# Altium project Level Shifter Pi Hat.PrjPcb
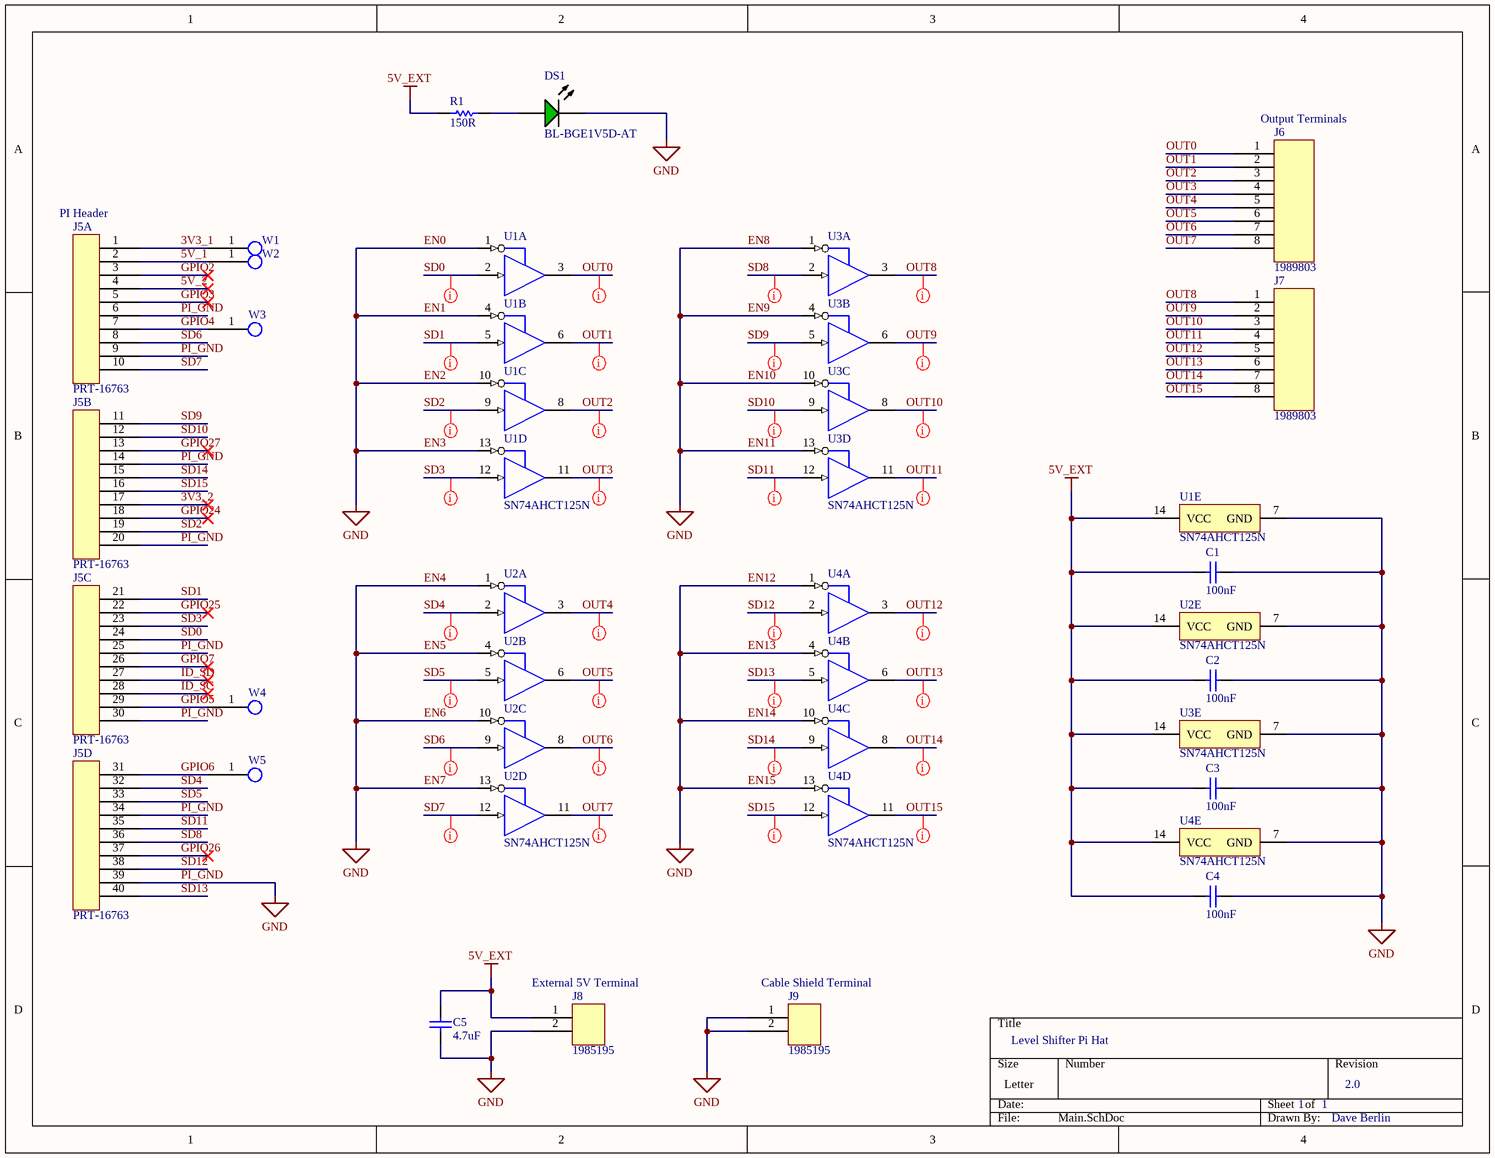
[diagram p0: Main.SchDoc]
DrawnBy: Dave Berlin; Revision: 2.0; Title: Level Shifter Pi Hat
1 sheet, 21 parts. Net scope: global (net labels, ports and power ports of the same name join across sheets).
Board file: Main.PcbDoc

## Sheet Main.SchDoc: Level Shifter Pi Hat
size Letter; SheetNumber: 1; SheetTotal: 1

### Parts
C1  value 100nF  [FP-CL21-IPC_A]  (hidden comment: CL21B104KBCNNNC)
C2  value 100nF  [FP-CL21-IPC_A]  (hidden comment: CL21B104KBCNNNC)
C3  value 100nF  [FP-CL21-IPC_A]  (hidden comment: CL21B104KBCNNNC)
C4  value 100nF  [FP-CL21-IPC_A]  (hidden comment: CL21B104KBCNNNC)
C5  value 4.7uF  [FP-CL21-IPC_A]  (hidden comment: CL21A475KAQNNNE)
DS1  BL-BGE1V5D-AT  [LED-2P-2.54-3MM]
J5  PRT-16763  [PRT-16763-Footprint-1]  (parts A,B,C,D of 4)
J6  1989803  [CONN_1989803_PXC]
J7  1989803  [CONN_1989803_PXC]
J8  1985195  [CONN_1985195_PXC]
J9  1985195  [CONN_1985195_PXC]
R1  value 150R  [STA_CF14_STP]  (hidden comment: CF14JT150R)
U1  SN74AHCT125N  [N0014A]  (value not drawn)  (parts A,B,C,D,E of 5)
U2  SN74AHCT125N  [N0014A]  (value not drawn)  (parts A,B,C,D,E of 5)
U3  SN74AHCT125N  [N0014A]  (value not drawn)  (parts A,B,C,D,E of 5)
U4  SN74AHCT125N  [N0014A]  (value not drawn)  (parts A,B,C,D,E of 5)
W1  WIRE-PAD-20AWG  [WIRE-PAD-20AWG]  (value not drawn)  (no BOM)
W2  WIRE-PAD-20AWG  [WIRE-PAD-20AWG]  (value not drawn)  (no BOM)
W3  WIRE-PAD-20AWG  [WIRE-PAD-20AWG]  (value not drawn)  (no BOM)
W4  WIRE-PAD-20AWG  [WIRE-PAD-20AWG]  (value not drawn)  (no BOM)
W5  WIRE-PAD-20AWG  [WIRE-PAD-20AWG]  (value not drawn)  (no BOM)

### Nets
5V_EXT: C1.1 C2.1 C3.1 C4.1 C5.2 J8.1 R1.1 U1.14(VCC) U2.14(VCC) U3.14(VCC) U4.14(VCC)
EN0: C1.2 C2.2 C3.2 C4.2 C5.1 DS1.2(K) J5.6 J5.9 J5.14 J5.20 J5.25 J5.30 J5.34 J5.39 J8.2 J9.1 J9.2 U1.1(1~{OE}) U1.4(2~{OE}) U1.7(GND) U1.10(3~{OE}) U1.13(4~{OE}) U2.1(1~{OE}) U2.4(2~{OE}) U2.7(GND) U2.10(3~{OE}) U2.13(4~{OE}) U3.1(1~{OE}) U3.4(2~{OE}) U3.7(GND) U3.10(3~{OE}) U3.13(4~{OE}) U4.1(1~{OE}) U4.4(2~{OE}) U4.7(GND) U4.10(3~{OE}) U4.13(4~{OE})  [also labelled EN1, EN10, EN11, EN12, EN13, EN14, EN15, EN2, EN3, EN4, EN5, EN6, EN7, EN8, EN9, GND, PI_GND]
3V3_1: J5.1 W1.1
3V3_2: J5.17
5V_1: J5.2 W2.1
5V_2: J5.4
GPIO2: J5.3
GPIO3: J5.5
GPIO4: J5.7 W3.1
GPIO5: J5.29 W4.1
GPIO6: J5.31 W5.1
GPIO7: J5.26
GPIO24: J5.18
GPIO25: J5.22
GPIO26: J5.37
GPIO27: J5.13
ID_SC: J5.28
ID_SD: J5.27
OUT0: J6.1 U1.3(1Y)
OUT1: J6.2 U1.6(2Y)
OUT2: J6.3 U1.8(3Y)
OUT3: J6.4 U1.11(4Y)
OUT4: J6.5 U2.3(1Y)
OUT5: J6.6 U2.6(2Y)
OUT6: J6.7 U2.8(3Y)
OUT7: J6.8 U2.11(4Y)
OUT8: J7.1 U3.3(1Y)
OUT9: J7.2 U3.6(2Y)
OUT10: J7.3 U3.8(3Y)
OUT11: J7.4 U3.11(4Y)
OUT12: J7.5 U4.3(1Y)
OUT13: J7.6 U4.6(2Y)
OUT14: J7.7 U4.8(3Y)
OUT15: J7.8 U4.11(4Y)
SD0: J5.24 U1.2(1A)
SD1: J5.21 U1.5(2A)
SD2: J5.19 U1.9(3A)
SD3: J5.23 U1.12(4A)
SD4: J5.32 U2.2(1A)
SD5: J5.33 U2.5(2A)
SD6: J5.8 U2.9(3A)
SD7: J5.10 U2.12(4A)
SD8: J5.36 U3.2(1A)
SD9: J5.11 U3.5(2A)
SD10: J5.12 U3.9(3A)
SD11: J5.35 U3.12(4A)
SD12: J5.38 U4.2(1A)
SD13: J5.40 U4.5(2A)
SD14: J5.15 U4.9(3A)
SD15: J5.16 U4.12(4A)
NetDS1_1: DS1.1(A) R1.2

### Layout directives
net class HighSpeed: OUT0, OUT1, OUT2, OUT3, OUT4, OUT5, OUT6, OUT7, OUT8, OUT9, OUT10, OUT11, OUT12, OUT13, OUT14, OUT15, SD0, SD1, SD2, SD3, SD4, SD5, SD6, SD7, SD8, SD9, SD10, SD11, SD12, SD13, SD14, SD15

### Notes on the sheet
- (near J6) Output Terminals
- (near J5) PI Header
- (near J8) External 5V Terminal
- (near J9) Cable Shield Terminal

### Library data of the parts
C1-C4 = CMP-001-00097-1: CAP CER 0.1UF 50V X7R 0805; Material: Ceramic; Tolerance: 10%; Depth: 1.25mm; Case Code (Imperial): 0805; Height: 0.85mm; Dielectric: X7R; Case/Package: 0805; Max Operating Temperature: 125°C; Voltage Rating: 50V; Radiation Hardening: No; RoHS Compliant: Yes; Mounting Technology: Surface Mount; Length: 2mm; Construction: Flat; Packaging: Tape and Reel; Lead Free: Lead Free; Min Operating Temperature: -55°C; Voltage: 50V; Case Code (Metric): 2012; Voltage Rating (DC): 50V; Series: CL; Width: 0.049inch; Thickness: 0.037inch
C5 = CMP-001-00095-2: CAP CER 4.7UF 25V X5R 0805; Tolerance: 10%; RoHS Compliant: Yes; Depth: 1.25mm; Min Operating Temperature: -55°C; Case/Package: 0805; Length: 2mm; Voltage Rating (DC): 25V; Max Operating Temperature: 85°C; Radiation Hardening: No; Lead Free: Lead Free; Height: 1.25mm; Dielectric: X5R; Construction: Flat; Series: CL; Voltage Rating: 25V; Case Code (Imperial): 0805; Packaging: Tape and Reel; Mounting Technology: Surface Mount; Case Code (Metric): 2012
DS1 = CMP-007-00038-2: LED Green, 80 mW, 30 mA Max, 200 mcd at 20 mA-40 to 85 degC, 2-Pin THD, RoHS, Bulk; Power: 80mW; Lens Style: Dome; Forward Voltage: 2V; Viewing Angle: 35degrees; Forward Current: 30mA; Case/Package: Radial; Colour: Green; Illumination Colour: Green; Mounting Technology: TH
J5 = CMP-002-00082-1: Extended GPIO Female Header - 2x20 Pin (16mm/7.30mm); Number of Positions: 40; Contact Shape: Square; Contact Type: Forked; Flammability Rating: UL94 V-0; Max Operating Temperature: 105°C; Fastening Type: Pull; Termination: Solder; Insulation Color: Black; Contact Finish - Mating: GOLD; Insulation Material: Nylon; Series: -; Number of Rows: 2; Contact Material: Brass; Mounting Technology: Through Hole; Min Operating Temperature: -40°C
J6 J7 = CMP-002-00083-1: Conn PC Terminal Block 8 POS 2.5mm Solder Thru-Hole 2A; Wire Gauge (Min): 20AWG; Number of Positions Per Level: 8; Voltage: 300V; Approvals: UL,VDE,EAC; Number of Levels: 1; Wire Gauge (Max): 26AWG; Voltage Rating: 250V; Weight: 0.109702oz; Packaging: Bulk; Package Quantity: 100; Pitch: 2.5mm; Height: 13.1mm; Number of Poles: 8; Min Operating Temperature: -40°C; Lead Free: Lead Free; Max Operating Temperature: 85°C; Wire/Cable Gauge: 20AWG; Current: 2A; Color: Green; Width: 21.5mm; Length: 12mm; Termination: Screwless; Series: PTSA; Contact Material: Copper Alloy; Material: Nylon; Number of Ways: 8; Number of Positions: 8; Pins: 8; RoHS Compliant: Yes; Current Rating: 2A; Number of Rows: 1; Mounting Technology: Through Hole; Housing Color: Green; Housing Material: Nylon
J8 J9 = CMP-002-00079-2: Conn PC Terminal Block 2 POS 3.5mm Solder Thru-Hole 8A Cardboard; Number of Positions: 2; Max Current Rating: 2A; Wire/Cable Gauge: 16AWG; Voltage Rating: 250V; Number of Levels: 1; Approvals: UL,VDE,EAC; Voltage: 300V; Wire Gauge (Max): 24AWG; Weight: 0.043387oz; Termination: Solder; Pins: 2; Housing Color: Green; Number of Ways: 2; Lead Free: Lead Free; Packaging: Bulk; Reach SVHC Compliant: Unknown; Height: 13.1mm; Material: Nylon; Current: 2A; Wire Gauge (Min): 16AWG; Color: Green; Pitch: 3.5mm; Depth: 12mm; Number of Circuits: 2; Number of Rows: 1; Package Quantity: 250; Width: 16.7mm; Contact Material: Tin; Housing Material: Polyamide; Number of Poles: 2; Length: 8.5mm; Flammability Rating: UL94 V-2; Current Rating: 2A; Number of Positions Per Level: 2; RoHS Compliant: Yes; Max Supply Voltage: 250V; Mounting Technology: Through Hole; Series: COMBICON PTSA; Number of Contacts: 2
R1 = CMP-009-00191-1: CF Series 0.25 W 150 Ohm ±5 % 0 to -400 ppm/°C Through Hole Carbon Film Resistor; Max Power Dissipation: 250mW; Tolerance: 5%; RoHS Compliant: Yes; Power Rating: 250mW; Contact Plating: Tin,Matte; Lead Free: Lead Free; Series: CF; Min Operating Temperature: -55°C; Number of Terminations: 2; Termination: Axial; Military Standard: Not; Radiation Hardening: No; Temperature Coefficient: -400ppm/°C; Packaging: Tape and Reel; Case/Package: Conformal; Construction: Cylindrical; Length: 6.5mm; Mounting Technology: Through Hole,Axial; Diameter: 2.3mm; Max Operating Temperature: 155°C; Features: Flame Retardant Coating
U1-U4 = CMP-024-00000-1: Buffer/Line Driver 4-CH Non-Inverting 3-ST CMOS 14-Pin PDIP Tube; Number of Elements: 4; Quiescent Current: 2uA; Min Supply Voltage: 4.5V; Turn-On Delay Time: 10ns; Number of Bits per Element: 1; Logic Function: Buffer,Inverting; Max Supply Voltage: 5.5V; High Level Output Current: -8mA; Output Type: 3-STATE; Operating Supply Voltage: 5V; Propagation Delay: 7.5ns; Low Level Output Current: 8mA; Packaging: Rail/Tube; Package Quantity: 25; Termination: Through Hole; Pins: 14; Number of Inputs: 4; Polarity: Non-Inverting; Technology: CMOS; Number of Channels: 4; Case/Package: PDIP; Series: 74AHCT; Max Operating Temperature: 125°C; Number of Bits: 4; Number of Outputs: 4; Number of Input Lines: 4; Reach SVHC Compliant: No; Number of Circuits: 4; Lead Free: Lead Free; Mounting Technology: Through Hole; RoHS Compliant: Yes; Min Operating Temperature: -40°C; Number of Output Lines: 4
W1-W5 = CMP-00028-00008-2: 38mil / 1.2mm Hole; Pins: 1